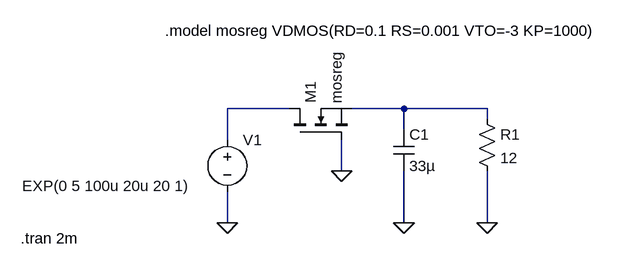
[diagram p0: schematic Regulator.asc]
Regulator.asc, the LTspice schematic file:
Version 4
SHEET 1 880 680
WIRE 128 176 32 176
WIRE 304 176 224 176
WIRE 432 176 304 176
WIRE 432 192 432 176
WIRE 304 208 304 176
WIRE 32 224 32 176
WIRE 208 272 208 224
WIRE 32 352 32 304
WIRE 304 352 304 272
WIRE 432 352 432 272
FLAG 32 352 0
FLAG 304 352 0
FLAG 432 352 0
FLAG 208 272 0
SYMBOL nmos 128 224 R270
SYMATTR InstName M1
SYMATTR Value mosreg
SYMBOL cap 288 208 R0
SYMATTR InstName C1
SYMATTR Value 33µ
SYMBOL res 416 176 R0
SYMATTR InstName R1
SYMATTR Value 12
SYMBOL voltage 32 208 R0
WINDOW 3 -316 87 Left 2
WINDOW 123 0 0 Left 0
WINDOW 39 0 0 Left 0
SYMATTR InstName V1
SYMATTR Value EXP(0 5 100u 20u 20 1)
TEXT -64 56 Left 2 !.model mosreg VDMOS(RD=0.1 RS=0.001 VTO=-3 KP=1000)
TEXT -286 376 Left 2 !.tran 2m

The netlist it stands for:
* Regulator.asc
M1 N001 0 N002 N002 mosreg
C1 N002 0 33µ
R1 N002 0 12
V1 N001 0 EXP(0 5 100u 20u 20 1)
.model NMOS NMOS
.model PMOS PMOS
.lib standard.mos
.model mosreg VDMOS(RD=0.1 RS=0.001 VTO=-3 KP=1000)
.tran 2m
.backanno
.end